# Altium schematic sheet HISTORY TABLE.SchDoc
size A2; Organization: Altium Limited; Address1: L3, 12a Rodborough Rd; Address2: Frenchs Forest; Address3: NSW; Address4: Australia 2086
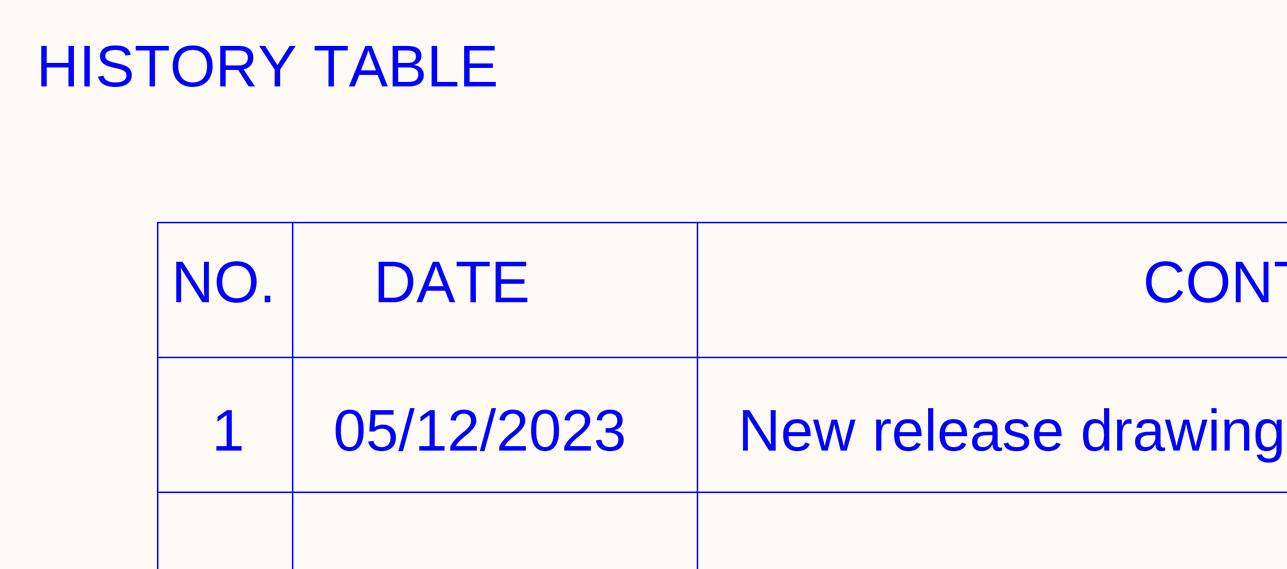
[diagram p0: HISTORY TABLE.SchDoc, left]
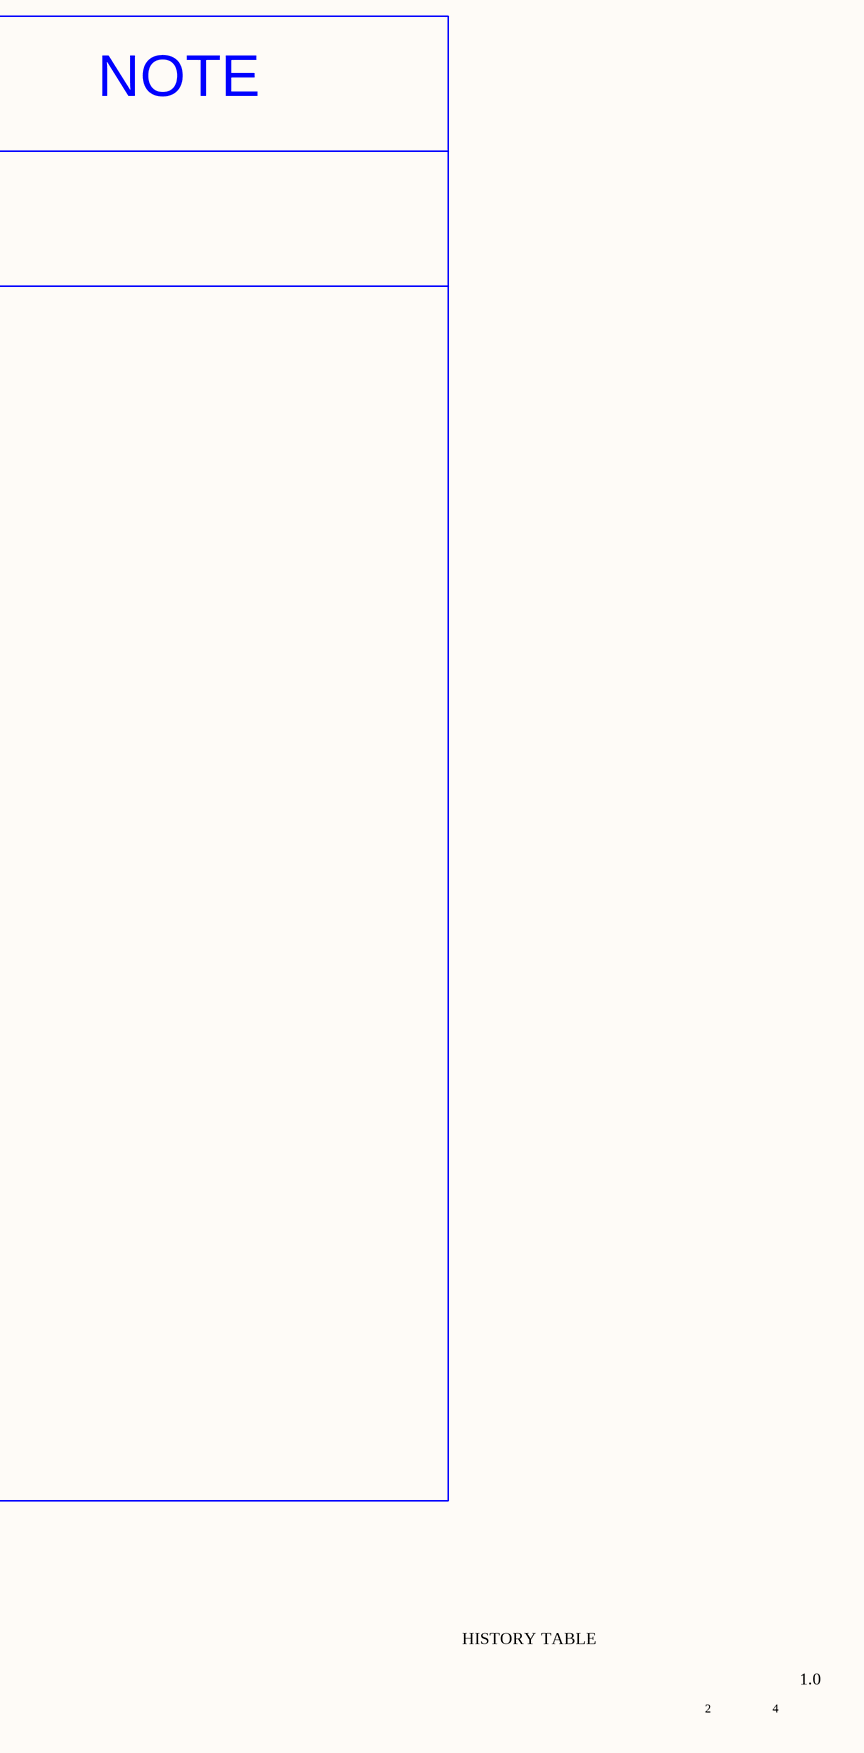
[diagram p1: HISTORY TABLE.SchDoc, right]

## Notes on the sheet
- HISTORY TABLE
- NO.
- DATE
- CONTENT
- NOTE
- 1
- 05/12/2023
- New release drawing version 1.0
- 2
- 4
- 1.0
- Title
- Size:
- Date:
- A4
- Number:
- Time:
- Revision:
- Sheet
- of
- File: